# Altium schematic sheet Host_FPGA_NonIO.SchDoc: HOST FPGA Pwr and Programming
size A4; Organization: Altium Limited.; Address1: Level 3, 12a Rodborough Rd; Address2: Frenchs Forest 2086; Address3: NSW; Address4: AUSTRALIA; DocumentNumber: 22; SheetNumber: 23; SheetTotal: 78
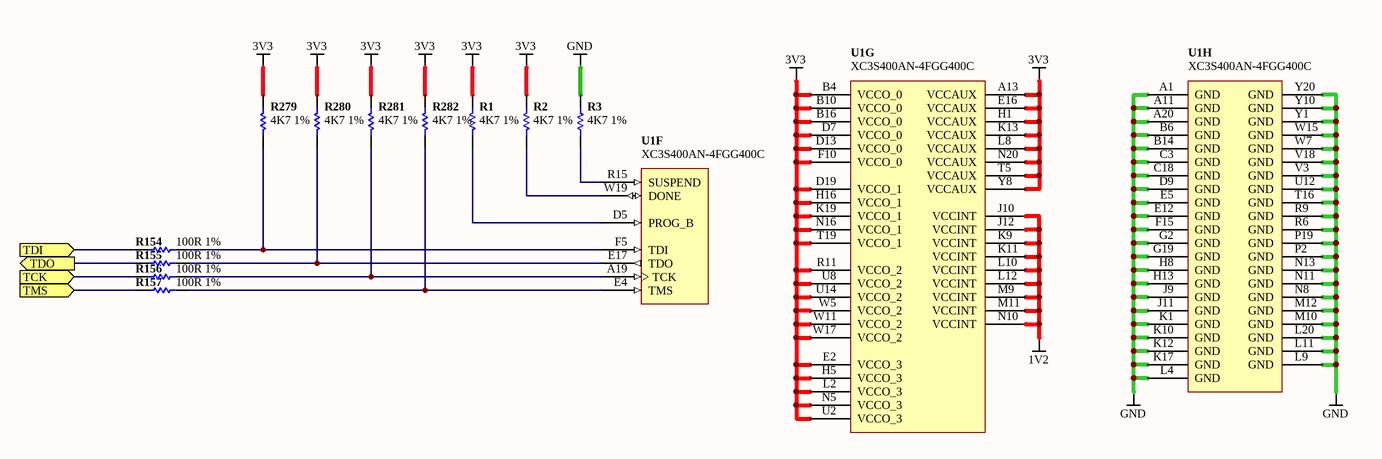
[diagram p0: Host_FPGA_NonIO.SchDoc]

## Parts
R1  4K7 1%  [RESC1005-STAR]
R2  4K7 1%  [RESC1005-STAR]
R3  4K7 1%  [RESC1005-STAR]
R154  100R 1%  [RESC1005-STAR]
R155  100R 1%  [RESC1005-STAR]
R156  100R 1%  [RESC1005-STAR]
R157  100R 1%  [RESC1005-STAR]
R279  4K7 1%  [RESC1005-STAR]
R280  4K7 1%  [RESC1005-STAR]
R281  4K7 1%  [RESC1005-STAR]
R282  4K7 1%  [RESC1005-STAR]
U1  XC3S400AN-4FGG400C  [FGG400]  (parts F,G,H of 8)

## Ports
TCK (in), TDI (in), TDO (out), TMS (in)

## Nets
1V2: U1.J10(VCCINT) U1.J12(VCCINT) U1.K9(VCCINT) U1.K11(VCCINT) U1.L10(VCCINT) U1.L12(VCCINT) U1.M9(VCCINT) U1.M11(VCCINT) U1.N10(VCCINT)
3V3: R1.1 R2.1 R279.1 R280.1 R281.1 R282.1 U1.A13(VCCAUX) U1.B4(VCCO_0) U1.B10(VCCO_0) U1.B16(VCCO_0) U1.D7(VCCO_0) U1.D13(VCCO_0) U1.D19(VCCO_1) U1.E2(VCCO_3) U1.E16(VCCAUX) U1.F10(VCCO_0) U1.H1(VCCAUX) U1.H5(VCCO_3) U1.H16(VCCO_1) U1.K13(VCCAUX) U1.K19(VCCO_1) U1.L2(VCCO_3) U1.L8(VCCAUX) U1.N5(VCCO_3) U1.N16(VCCO_1) U1.N20(VCCAUX) U1.R11(VCCO_2) U1.T5(VCCAUX) U1.T19(VCCO_1) U1.U2(VCCO_3) U1.U8(VCCO_2) U1.U14(VCCO_2) U1.W5(VCCO_2) U1.W11(VCCO_2) U1.W17(VCCO_2) U1.Y8(VCCAUX)
GND: R3.1 U1.A1(GND) U1.A11(GND) U1.A20(GND) U1.B6(GND) U1.B14(GND) U1.C3(GND) U1.C18(GND) U1.D9(GND) U1.E5(GND) U1.E12(GND) U1.F15(GND) U1.G2(GND) U1.G19(GND) U1.H8(GND) U1.H13(GND) U1.J9(GND) U1.J11(GND) U1.K1(GND) U1.K10(GND) U1.K12(GND) U1.K17(GND) U1.L4(GND) U1.L9(GND) U1.L11(GND) U1.L20(GND) U1.M10(GND) U1.M12(GND) U1.N8(GND) U1.N11(GND) U1.N13(GND) U1.P2(GND) U1.P19(GND) U1.R6(GND) U1.R9(GND) U1.T16(GND) U1.U12(GND) U1.V3(GND) U1.V18(GND) U1.W7(GND) U1.W15(GND) U1.Y1(GND) U1.Y10(GND) U1.Y20(GND)
TCK: R156.1 ; port TCK
TDI: R154.1 ; port TDI
TDO: R155.1 ; port TDO
TMS: R157.1 ; port TMS
NetR1_2: R1.2 U1.D5(PROG_B)
NetR2_2: R2.2 U1.W19(DONE)
NetR3_2: R3.2 U1.R15(SUSPEND)
NetR154_2: R154.2 R279.2 U1.F5(TDI)
NetR155_2: R155.2 R280.2 U1.E17(TDO)
NetR156_2: R156.2 R281.2 U1.A19(TCK)
NetR157_2: R157.2 R282.2 U1.E4(TMS)

## Notes on the sheet
- Sheet Title
- Project Title
- Size:
- Date:
- A4
- Assy:
- Time:
- Revision:
- Sheet
- of
- File:

## Library data of the parts
R1-R3 R279-R282 = D-100-0088: Resistor, 4K7 1% 0402 (1005); Power Rating: 63 mW; Resistance: 4.7 K; Category: Resistor; Mounting Technology: Surface Mount; Status: Production; Tolerance: 1 %
R154-R157 = D-100-0131: Resistor, 100R 1% 0402 (1005); Power Rating: 63 mW; Mounting Technology: Surface Mount; Resistance: 100 R; Status: Production; Tolerance: 1 %; Category: Resistor
U1 = D-241-0024: FPGA, Xilinx Spartan3-400 Standard Speed, BGA 1.0mm pitch, 400 balls, 0 to 85 degC; Supply Voltage: 1.2, 2.5, and 3.3 V; Mounting Technology: Surface Mount; Status: Unreleased; Technology: SRAM; Temperature Range: 0 to 85; Category: IC-FPGA; NexusDeviceId: XC3S400AN-4FGG400C